# EAGLE design oresat-zpos-endcap (EAGLE 9.2.2)
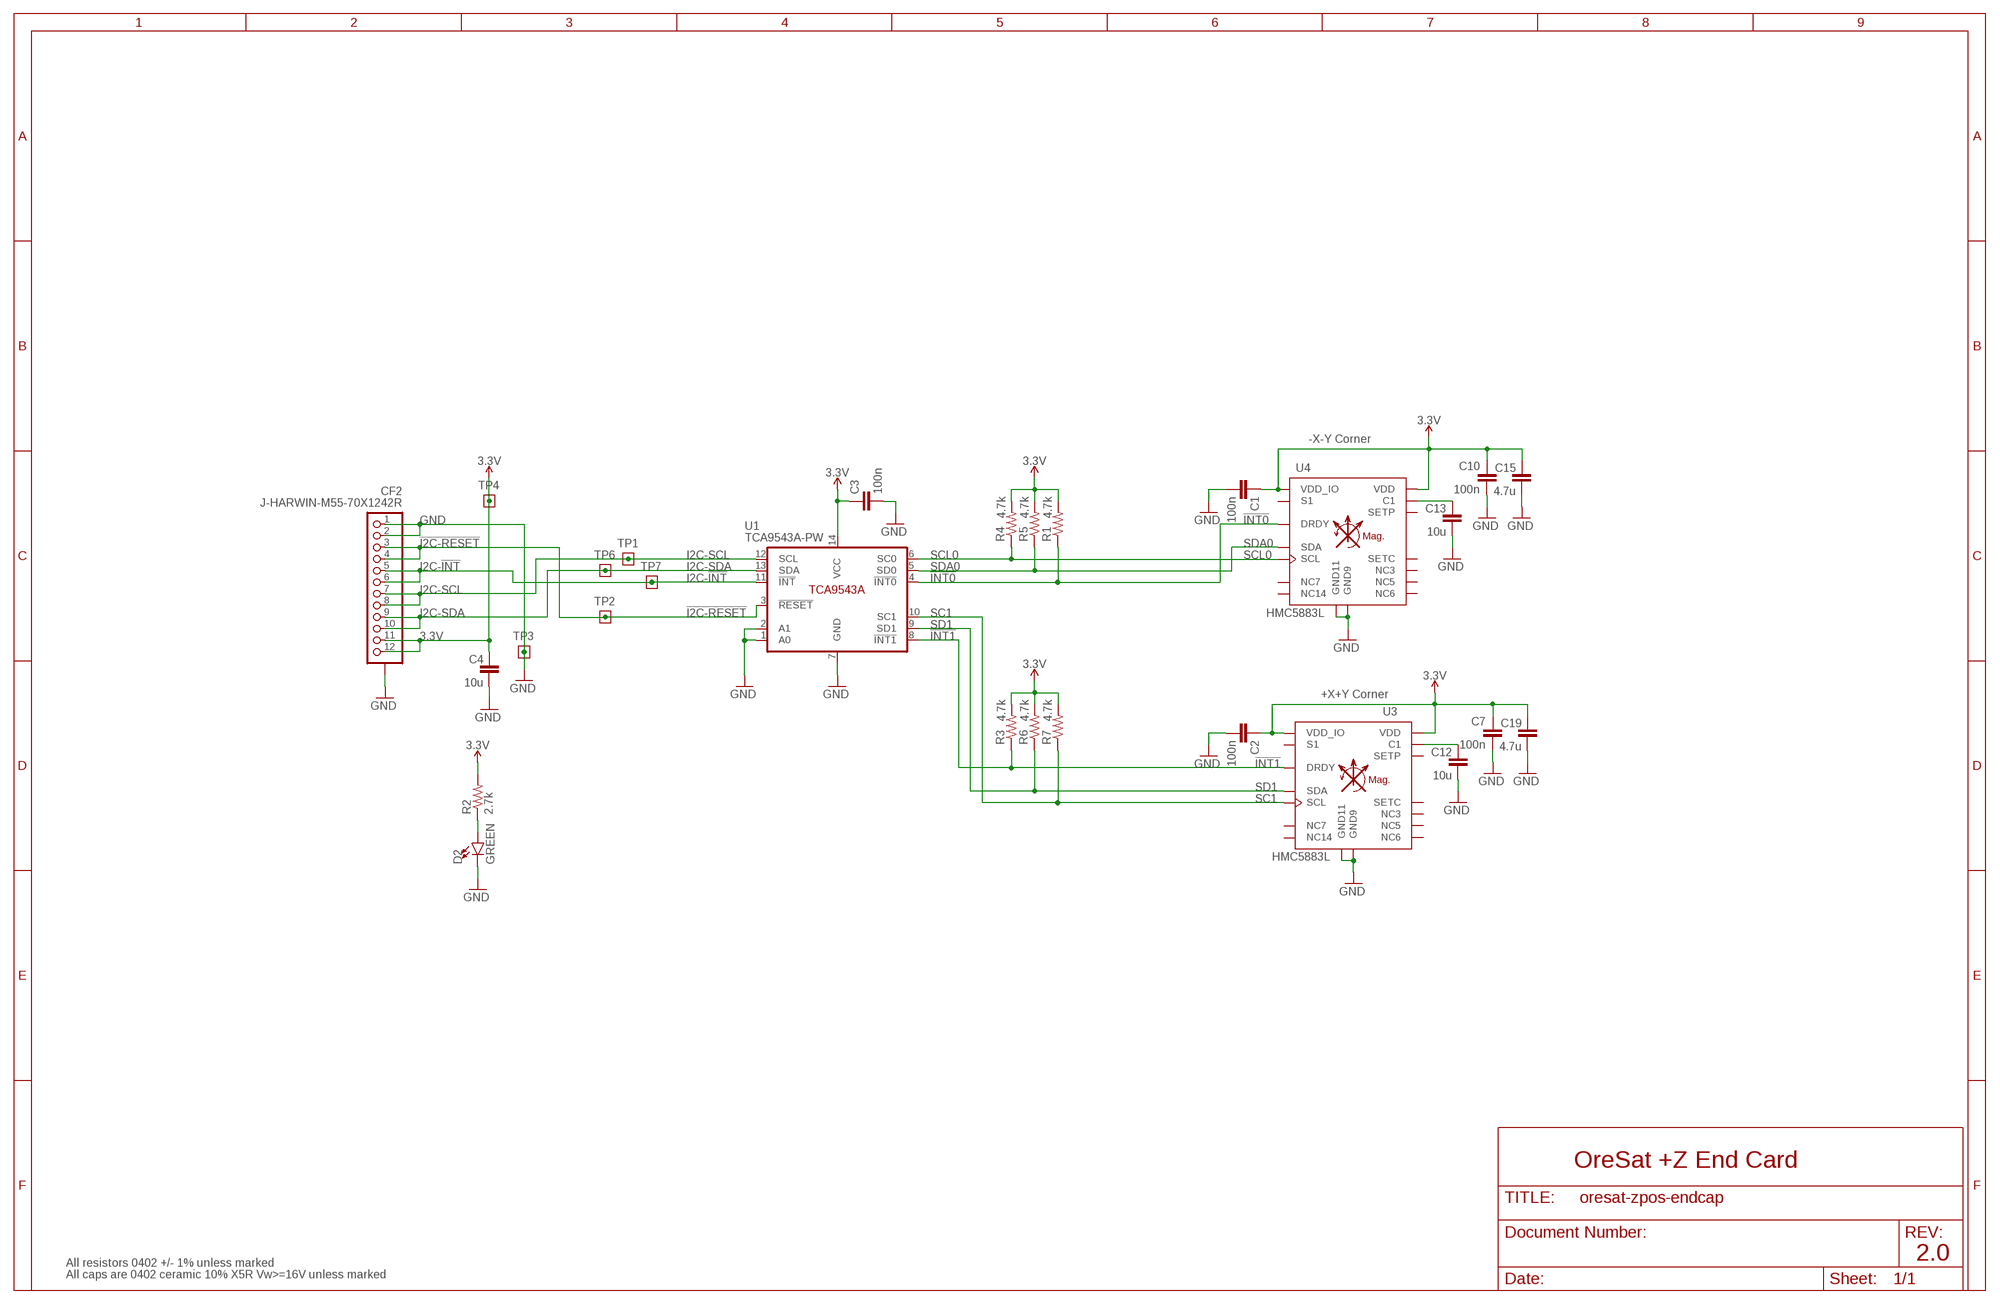
[diagram p0: schematic, sheet 1]

## Parts
C1  100n  C-EU0402-B-NOSILK  [.0402-B-NOSILK]
C2  100n  C-EU0402-B-NOSILK  [.0402-B-NOSILK]
C3  100n  C-EU0402-B-NOSILK  [.0402-B-NOSILK]
C4  10u  C-EU0603-B-NOSILK  [.0603-B-NOSILK]
C7  100n  C-EU0402-B-NOSILK  [.0402-B-NOSILK]
C10  100n  C-EU0402-B-NOSILK  [.0402-B-NOSILK]
C12  10u  C-EU0603-B-NOSILK  [.0603-B-NOSILK]
C13  10u  C-EU0603-B-NOSILK  [.0603-B-NOSILK]
C15  4.7u  C-EU0603-B-NOSILK  [.0603-B-NOSILK]
C19  4.7u  C-EU0603-B-NOSILK  [.0603-B-NOSILK]
CF2  J-HARWIN-M55-70X1242R  [HARWIN-M55-70X1242R]
D2  GREEN  LED-GREEN0603  [LED-0603]
R1  4.7k  R-US_0402-B-NOSILK  [.0402-B-NOSILK]
R2  2.7k  R-US_0402-B-NOSILK  [.0402-B-NOSILK]
R3  4.7k  R-US_0402-B-NOSILK  [.0402-B-NOSILK]
R4  4.7k  R-US_0402-B-NOSILK  [.0402-B-NOSILK]
R5  4.7k  R-US_0402-B-NOSILK  [.0402-B-NOSILK]
R6  4.7k  R-US_0402-B-NOSILK  [.0402-B-NOSILK]
R7  4.7k  R-US_0402-B-NOSILK  [.0402-B-NOSILK]
TP1  TEST-POINT  [2MM-TEST-POINT]
TP2  TEST-POINT  [2MM-TEST-POINT]
TP3  TEST-POINT  [2MM-TEST-POINT]
TP4  TEST-POINT  [2MM-TEST-POINT]
TP6  TEST-POINT  [2MM-TEST-POINT]
TP7  TEST-POINT  [2MM-TEST-POINT]
U1  TCA9543A-PW  [TSSOP14-0.65-5.4X4.4MM]
U3  HMC5883L  HMC5883L-LGA-16  [QLGA-16(3X3)]
U4  HMC5883L  HMC5883L-LGA-16  [QLGA-16(3X3)]

## Nets
3.3V: C1.1 C2.1 C3.1 C4.1 C7.1 C10.1 C15.1 C19.1 CF2.11 CF2.12 R1.2 R2.2 R3.2 R4.2 R5.2 R6.2 R7.2 TP4.1 U1.14(VCC) U3.2(VDD) U3.13(VDD_IO) U4.2(VDD) U4.13(VDD_IO)
!I2C-RESET: CF2.3 CF2.4 TP2.1 U1.3(!RESET)
!INT0: R1.1 U1.4(!INT0) U4.15(DRDY)
!INT1: R3.1 U1.8(!INT1) U3.15(DRDY)
GND: C1.2 C2.2 C3.2 C4.2 C7.2 C10.2 C12.2 C13.2 C15.2 C19.2 CF2.1 CF2.2 CF2.P$1(SHIELDS) CF2.P$2(SHIELDS) CF2.P$3(SHIELDS) CF2.P$4(SHIELDS) D2.C TP3.1 U1.1(A0) U1.2(A1) U1.7(GND) U3.9(GND9) U3.11(GND11) U4.9(GND9) U4.11(GND11)
I2C-!INT: CF2.5 CF2.6 TP7.1 U1.11(!INT)
I2C-SCL: CF2.7 CF2.8 TP1.1 U1.12(SCL)
I2C-SDA: CF2.9 CF2.10 TP6.1 U1.13(SDA)
N$2: C12.1 U3.10(C1)
N$5: C13.1 U4.10(C1)
N$271: D2.A R2.1
SC1: R7.1 U1.10(SC1) U3.1(SCL)
SCL0: R4.1 U1.6(SC0) U4.1(SCL)
SD1: R6.1 U1.9(SD1) U3.16(SDA)
SDA0: R5.1 U1.5(SD0) U4.16(SDA)
Unconnected: U3.3(NC3) U3.4(S1) U3.5(NC5) U3.6(NC6) U3.7(NC7) U3.8(SETP) U3.12(SETC) U3.14(NC14) U4.3(NC3) U4.4(S1) U4.5(NC5) U4.6(NC6) U4.7(NC7) U4.8(SETP) U4.12(SETC) U4.14(NC14)

## Notes on the sheet
- -X-Y Corner
- +X+Y Corner
- OreSat +Z End Card
- 2.0
- All resistors 0402 +/- 1% unless marked
- All caps are 0402 ceramic 10% X5R Vw>=16V unless marked

## Library data of the parts
C1-C3 C7 C10 = rcl_custom:C-EU: CAPACITOR, European symbol; DIS: Digi-Key; DPN: 1276-1001-1-ND; MFR: Samsung; MPN: CL05B104KO5NNNC
C4 C12 C13 C15 C19 = oresat-rcl:C-EU: CAPACITOR, European symbol; DIS: Digi-Key; DPN: 1276-1001-1-ND; MFR: Samsung; MPN: CL05B104KO5NNNC
CF2 = J-Harwin-M55-70X1242R-12pin-1.27mm-M-vertical:J-HARWIN-M55-70X1242R
D2 = SparkFun-LED:LED-GREEN: Green SMD LED Used in manufacturing of various products at SparkFun Packages: 0603 - SMD 0603 package [Product Link] <http://www.futureelectronics.com/en/technologies/semiconductors/optoelectronics/leds/Pages/9894312-LTST-C190GKT.aspx?CrossPart=HSMG-C190&IM=0> LilyPad 1206 - SMD1206 LilyPad package [Product Link] <http://www.futureelectronics.com/en/Technologies/Product.aspx?ProductID=IN150NGHARVATEKCORPORATION2049943&IM=0> 1206 - SMD1206 package [Product Link] <http://www.futureelectronics.com/en/technologies/semiconductors/optoelectronics/leds/Pages/8315665-LTST-C150KGKT.aspx?IM=0> 1206 Bottom Mount -SMD 1206 Bottom Mount [Product Link] <http://www.digikey.com/product-detail/en/lite-on-inc/LTST-C230KGKT/160-1456-1-ND/386854> SparkFun Products: Pro Mini 328 -5V <https://www.sparkfun.com/products/821> RedBoard <https://www.sparkfun.com/products/12757> MP3 Trigger <https://www.sparkfun.com/products/13720> Makey Makey <https://www.sparkfun.com/products/11076>; PROD_ID: DIO-00821
R1-R7 = rcl_custom:R-US_: RESISTOR, American symbol; DIS: Digi-Key; DPN: 1276-4275-1-ND; MFR: Samsung; MPN: RC1005F6653CS
TP1-TP4 TP6 TP7 = Tova:TEST-POINT
U1 = U-TI-TCA9543A-I2C-2-to-1-multiplexer:TCA9543A-PW
U3 U4 = monitor-v2:HMC5883L: Honeywell HMC5883L 3-axis Digital Compass with I2C interface

## Board
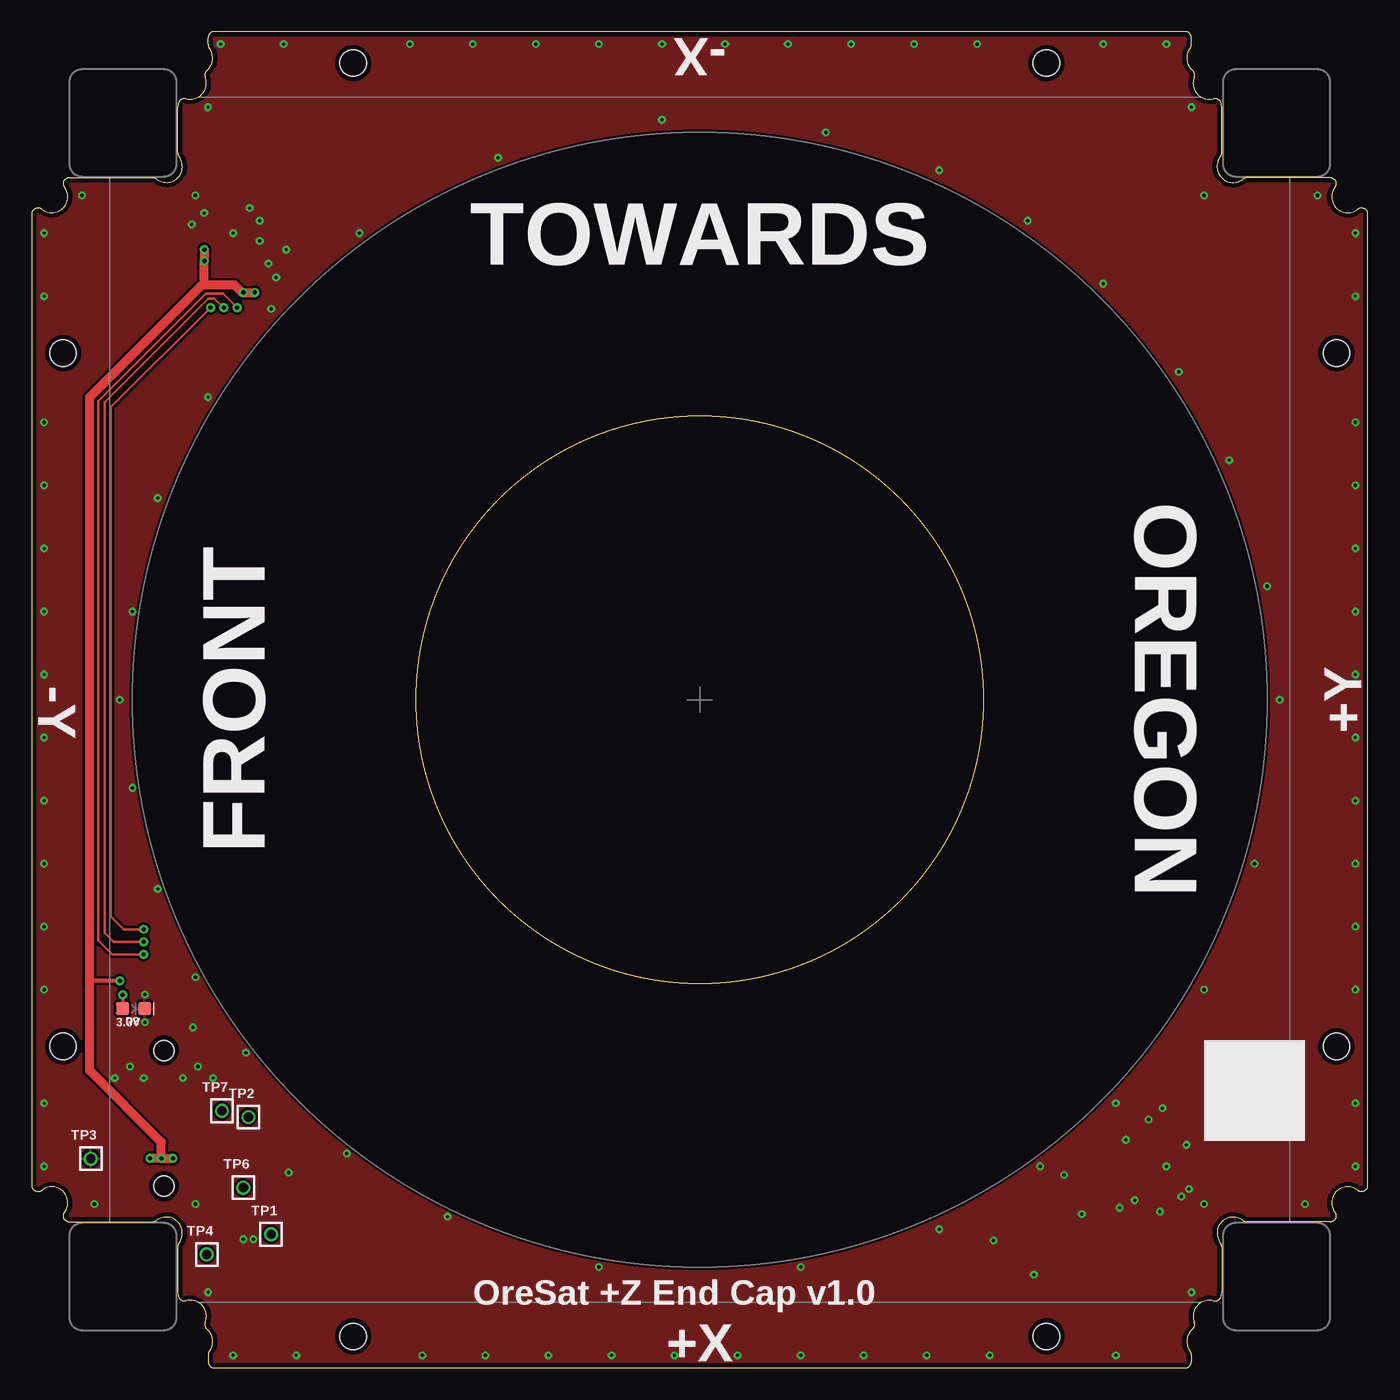
[diagram p1: board, top side]
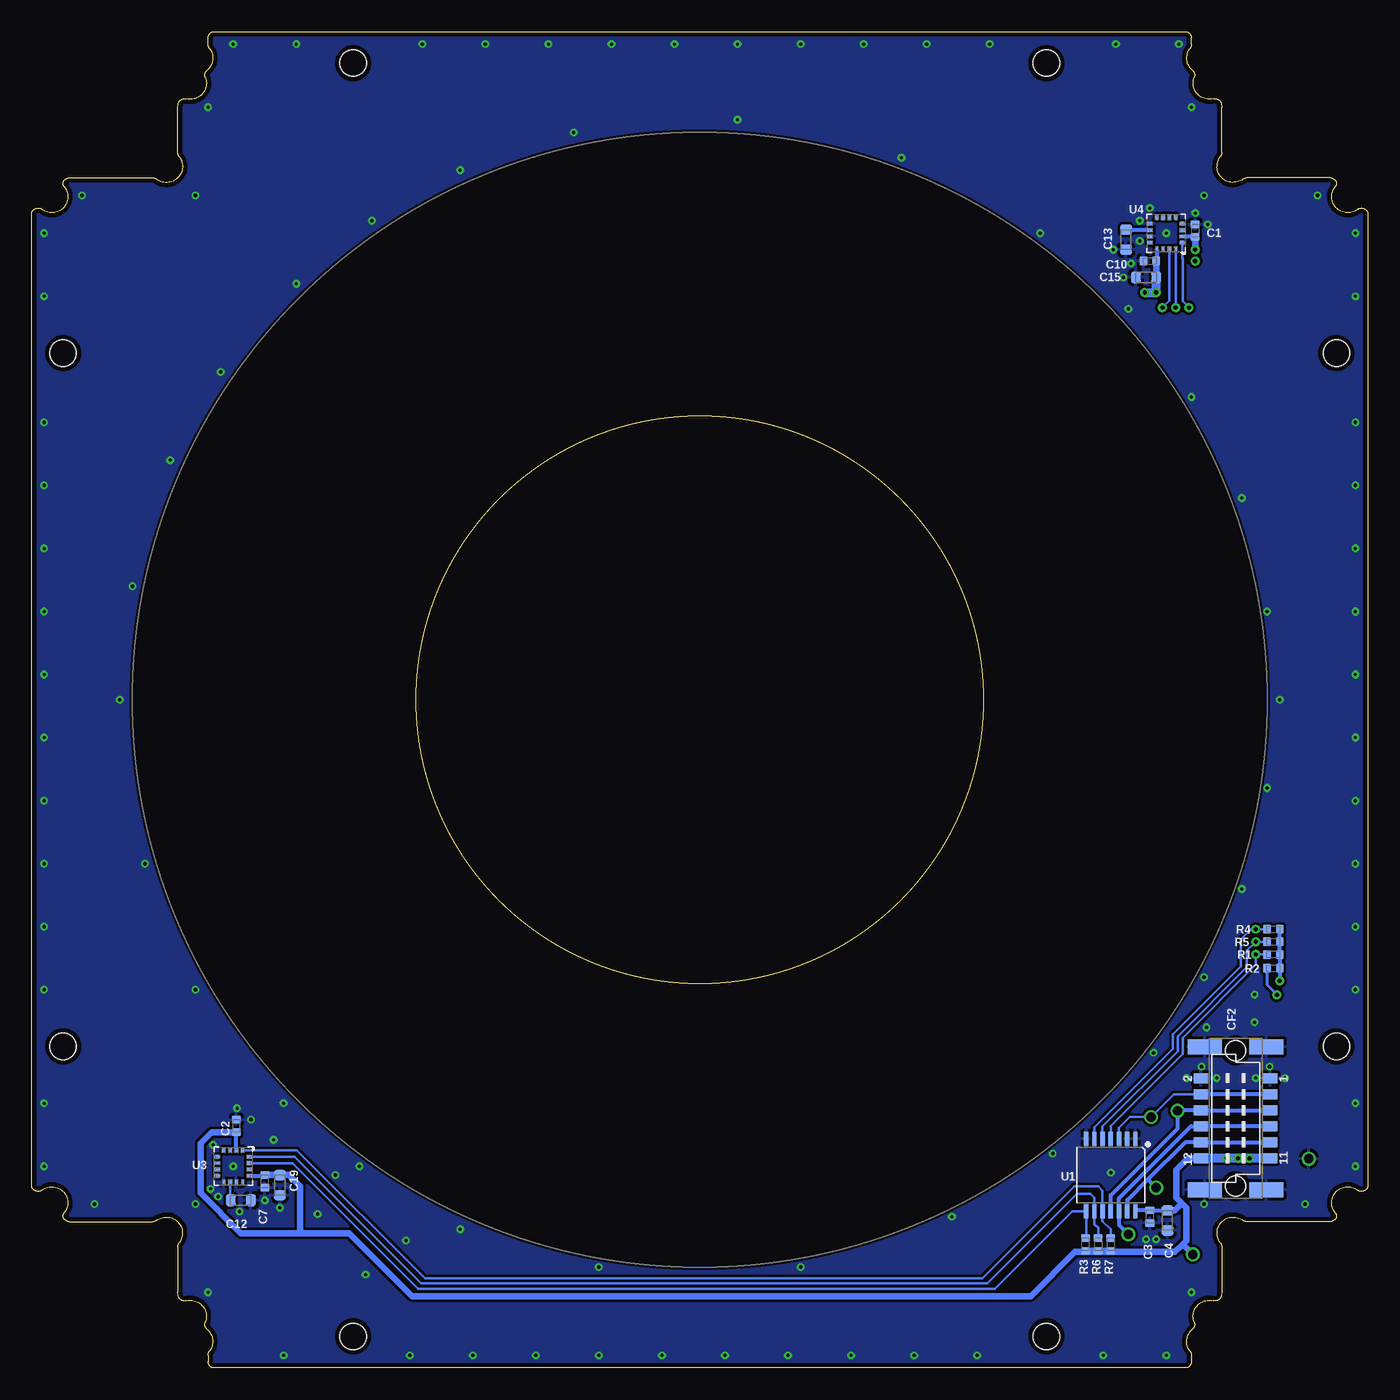
[diagram p2: board, bottom side, seen from below]

Size 106 x 106 mm. Coordinates in mm from the lower left corner, seen from the top.
Outline: 3,94.4 arc85 2.5,93.94 arc33 2.6,93.68 arc-166 0.82,91.89 arc38 0.52,92 0.5,92 arc90 0,91.5 0,14.5 arc90 0.5,14 0.52,14 arc38 0.83,14.11 arc-166 2.6,12.32 arc33 2.5,12.06 arc85 3,11.6 9.62,11.6 arc38 9.92,11.7 arc-166 11.71,9.92 arc38 11.6,9.62 11.6,6 arc22 11.68,5.61 arc83 12.27,5.33 arc-127 13.78,3.63 arc71 13.92,3.07 arc-87 14.11,1.32 arc38 14,1.02 14,0.5 arc90 14.5,0 91.5,0 arc90 92,0.5 92,1.02 arc38 91.9,1.32 arc-87 92.08,3.07 arc71 92.22,3.63 arc-127 93.73,5.33 arc83 94.32,5.61 arc22 94.4,6 94.4,9.62 arc38 94.3,9.92 arc-166 96.08,11.71 arc38 96.38,11.6 103,11.6 arc85 103.5,12.06 arc33 103.39,12.32 arc-166 105.18,14.11 arc38 105.48,14 105.5,14 arc90 106,14.5 106,91.5 arc90 105.5,92 105.48,92 arc38 105.17,91.89 arc-166 103.39,93.68 arc33 103.5,93.94 arc85 103,94.4 96.38,94.4 arc38 96.08,94.29 arc-166 94.3,96.08 arc38 94.4,96.38 94.4,100 arc22 94.32,100.38 arc83 93.73,100.67 arc-127 92.22,102.36 arc71 92.08,102.93 arc-87 91.89,104.68 arc38 92,104.98 92,105.5 arc90 91.5,106 14.5,106 arc90 14,105.5 14,104.98 arc38 14.1,104.68 arc-87 13.92,102.93 arc71 13.78,102.37 arc-127 12.27,100.67 arc83 11.68,100.38 arc22 11.6,100 11.6,96.38 arc38 11.71,96.08 arc-166 9.92,94.3 arc38 9.62,94.4 3,94.4
Outline: circle at 53,53 radius 22.5
Copper layers (1*16): Top 0.0356mm / dielectric 1.5011mm / Bottom 0.0356mm
Design rules "OSH-Park-2-layer *": minimum track width 6mil, minimum drill 10mil, track to track 6mil, track to pad 6mil, pad to pad 6mil, via to via 6mil, smd to smd 6mil, copper to edge 15mil, drill to drill 6mil, minimum pad ring 7mil, minimum via ring 7mil, stop-mask expansion 3mil, vias tented up to drill 13mil, thermal gap 10mil
Holes 2.1 mm at 25.5,2.5 2.5,25.5 2.5,80.5 25.5,103.5 80.5,103.5 103.5,80.5 103.5,25.5 80.5,2.5
tRestrict: area 8,8 to 98,98
bRestrict: area 8,8 to 98,98

### Footprints (pad centres in the part's own frame; a part is rotated, then mirrored left to right if it is on the bottom)
.0402-B-NOSILK = smd 0.6 x 0.7: 1 -0.5,0; 2 0.5,0
.0603-B-NOSILK = smd 0.8 x 0.95: 1 -0.8,0; 2 0.8,0
HARWIN-M55-70X1242R = smd 0.8 x 1.1: 1 3.175,-2.75; 2 3.175,2.75; 3 1.905,-2.75; 4 1.905,2.75; 5 0.635,-2.75; 6 0.635,2.75; 7 -0.635,-2.75; 8 -0.635,2.75; 9 -1.905,-2.75; 10 -1.905,2.75; 11 -3.175,-2.75; 12 -3.175,2.75 | smd 1.2 x 2.7: P$1 -5.67,-2.45; P$2 -5.67,2.45; P$3 5.67,2.45; P$4 5.67,-2.45 | hole 1.6: -5.385,0; 5.385,0
LED-0603 = smd 1 x 1: A -0.877,0; C 0.877,0
2MM-TEST-POINT = drill 0.737: 1 0,0
TSSOP14-0.65-5.4X4.4MM = smd 0.35 x 1.1: 1 -1.95,-2.86; 2 -1.3,-2.86; 3 -0.65,-2.86; 4 0,-2.86; 5 0.65,-2.86; 6 1.3,-2.86; 7 1.95,-2.86; 8 1.95,2.86; 9 1.3,2.86; 10 0.65,2.86; 11 0,2.86; 12 -0.65,2.86; 13 -1.3,2.86; 14 -1.95,2.86
QLGA-16(3X3) = smd 0.45 x 0.3: 1 -1.275,0.75; 2 -1.275,0.25; 3 -1.275,-0.25; 4 -1.275,-0.75; 9 1.275,-0.75; 10 1.275,-0.25; 11 1.275,0.25; 12 1.275,0.75 | smd 0.3 x 0.45: 5 -0.75,-1.275; 6 -0.25,-1.275; 7 0.25,-1.275; 8 0.75,-1.275; 13 0.75,1.275; 14 0.25,1.275; 15 -0.25,1.275; 16 -0.75,1.275

### Placement (x,y rotation side)
C1  13.7,90.2 90 bottom
C2  89.75,19.2 90 bottom
C3  17.3,12 270 bottom
C4  15.9,11.7 270 bottom
C7  87.5,14.8 270 bottom
C10  17.3,87.8 180 bottom
C12  89.4,13.3 0 bottom
C13  19.2,89.5 270 bottom
C15  17.6,86.5 180 bottom
C19  86.3,14.5 270 bottom
CF2  10.5,19.8 90 bottom
D2  8.1,28.5 0 top
R1  7.5,32.8 0 bottom
R2  7.5,31.7 0 bottom
R3  22.4,9.8 270 bottom
R4  7.5,34.8 0 bottom
R5  7.5,33.8 0 bottom
R6  21.4,9.8 270 bottom
R7  20.4,9.8 270 bottom
TP1  19,10.6 0 top
TP2  17.2,19.9 0 top
TP3  4.7,16.6 0 top
TP4  13.9,9 0 top
TP6  16.8,14.3 0 top
TP7  15.1,20.4 0 top
U1  20.4,15.3 180 bottom
U3  90,16 270 bottom
U4  16,90 180 bottom

### Tracks (layer width: path | path; a pad name or v marks a point on that pad's centre or on a via)
3.3V  (via drill 0.35)
  Top 0.3: v7,30.7 4.6,30.7
  Top 0.7: v10.3,16.62 10.3,17.9 4.6,23.6 4.6,30.7 4.6,77 13.5,85.9 | v10.3,16.62 v11.2,16.62 | v10.3,16.62 v9.4,16.62 | v13.7,88.7 v13.7,87.8 13.7,86.1 13.5,85.9 | v17.7,85.3 v16.8,85.3 16.7,85.3 16.1,85.9 13.5,85.9
  Bottom 0.3: U3.13 87.55,15.25 C7.1 | U3.2 C2.1 | U1.14 18.39,12.5 C3.1 C4.1 | R4.2 R5.2 R1.2 R2.2 v7,30.7 | U4.13 16.75,87.85 C10.1 | U4.2 13.75,89.75 C1.1
  Bottom 0.5: C7.1 C19.1 85.6,15.3 84.7,14.4 84.7,10.7 | C2.1 91.7,18.7 92.6,17.8 92.6,13.9 89.4,10.7 84.7,10.7 | 84.7,10.7 80.8,10.7 75.8,5.7 26.75,5.7 23.25,9.2 22.5,9.2 | CF2.12 14.28,16.62 15.2,15.7 15.2,13.5 14.75,13.05 | 14.7,9.8 14.4,10.1 14.4,12.7 14.75,13.05 | 14.7,9.8 15.3,9.2 22.5,9.2 | C4.1 15.3,12.5 14.75,13.05 | 22.5,9.2 R3.2 R6.2 R7.2 | C15.1 C10.1 | 14.7,9.8 TP4.1 | C1.1 v13.7,88.7
  Bottom 0.7: CF2.11 v10.3,16.62 CF2.12 | C15.1 v16.8,85.3 v17.7,85.3
!I2C-RESET
  Bottom 0.2: CF2.4 15.39,21.7 TP2.1 18.9,19.9 19.75,19.05 U1.3
  Bottom 0.3: CF2.3 CF2.4
!INT0  (via drill 0.35)
  Top 0.2: v8.9,32.8 6.4,32.8 5.3,33.9 5.3,76.7 13.8,85.2 15.2,85.2 v16.3,84.1
  Bottom 0.2: U1.4 20.4,19.2 14.7,24.9 14.7,26.2 8.9,32 v8.9,32.8 R1.1 | U4.15 15.75,84.65 v16.3,84.1
!INT1
  Bottom 0.2: U3.15 85.29,16.25 75.34,6.3 29.6,6.3 23.46,12.44 U1.8 22.35,10.35
  Bottom 0.3: 22.35,10.35 R3.1
GND  (via drill 0.25)
  other vias: 12.8,27.02 90,16 91.8,14.2 89.5,12.4 87.5,13.3 91.6,17.7 86.3,12.7 83.3,12.2 88.6,19.7 86.8,18.1 81.9,15.3 76.3,10.1 79.5,7.4 20.4,15.5 17.6,10.2 16.8,10.2 9,29.62 9,27.42 1,16 1,21 1,30 1,35 1,40 1,45 1,50 1,55 1,60 1,65 1,70 1,75 1,90 1,85 105,16 105,21 105,30 105,35 105,40 105,45 105,50 105,55 105,60 105,65 105,70 105,75 105,90 105,85 15,105 20,105 30,105 35,105 40,105 45,105 50,105 55,105 60,105 65,105 70,105 75,105 85,105 90,105 16,1 21,1 31,1 36,1 41,1 46,1 51,1 56,1 61,1 66,1 71,1 76,1 86,1 10,38 10,69 14,77 19,84 26,90 37,96 50,99 63,98 72,95 79,91 85,86 91,79 95,72 98,62 99,53 97,40 93,30 86,21 80,16 72,11 61,8 33,12 25,17 13,31 16,90 13.7,91.6 12.7,90.7 20.2,88.7 18.8,87.6 18.1,89.4 19.4,86.5 18.1,91 17.3,92 89.7,20.6 91.2,13.6 4,93 14,100 92,100 93,93 102,93 101,13 92,6 93,13 13,93 14,6 13,13 5,13 14.4,23 13.2,23.9 12,23 8.9,23 7.8,23.9 6.6,23 8,60 17,25 45,8 8,46 7,53
  pour Top (isolate 0.2, rank 6): 0,0 106,0 106,106 0,106
  pour Bottom (isolate 0.2, rank 6): 0,0 106,0 106,106 0,106
I2C-!INT
  Bottom 0.3: CF2.5 CF2.6 15.06,20.43 TP7.1 15.1,19 20.4,13.7 U1.11
I2C-SCL
  Bottom 0.3: CF2.7 CF2.8 14.04,19.16 19.75,13.45 U1.12 19.75,11.35 TP1.1
I2C-SDA
  Bottom 0.3: CF2.9 CF2.10 14.51,17.89 17.45,14.95 | U1.13 19.1,13.3 17.45,14.95 | TP6.1 17.45,14.95
N$2
  Bottom 0.2: U3.10 90.25,13.35 C12.1
N$5
  Bottom 0.3: U4.10 19.15,90.25 C13.1
N$271  (via drill 0.35)
  Top 0.25: v7.22,29.59 D2.A
  Bottom 0.25: v7.22,29.59 7.22,29.62 8,30.4 R2.1
SC1
  Bottom 0.2: U3.1 84.97,17.27 74.8,7.1 30.6,7.1 23.3,14.4 21.4,14.4 21.05,14.05 U1.10 21.05,11.65 20.4,11 R7.1
SCL0  (via drill 0.35)
  Top 0.2: v8.9,34.8 7.3,34.8 6.3,35.8 6.3,76.2 v14.2,84.1
  Bottom 0.2: U1.6 21.7,19.1 15.48,25.32 15.48,26.46 10.1,31.84 10.1,34 9.3,34.8 v8.9,34.8 R4.1 | U4.1 14.72,88.03 14.7,88 14.7,84.6 v14.2,84.1
SD1
  Bottom 0.2: U3.16 85.15,16.75 75.1,6.7 30.2,6.7 23.1,13.8 22,13.8 21.7,13.5 U1.9 21.7,11.4 21.4,11.1 R6.1
SDA0  (via drill 0.35)
  Top 0.2: v8.9,33.8 6.5,33.8 5.8,34.5 5.8,76.6 14,84.8 14.5,84.8 v15.25,84.1
  Bottom 0.2: U1.5 21.05,19.15 15.1,25.1 15.1,26.3 9.6,31.8 9.6,33.1 v8.9,33.8 R5.1 | v15.25,84.1 U4.16

### Text on the board
tPlace: -X | TOWARDS | FRONT | OREGON | +Y | -Y | 3.3V | OreSat +Z End Cap v1.0 | +X